# EAGLE design Qwiic_Relay (EAGLE 9.1.0)
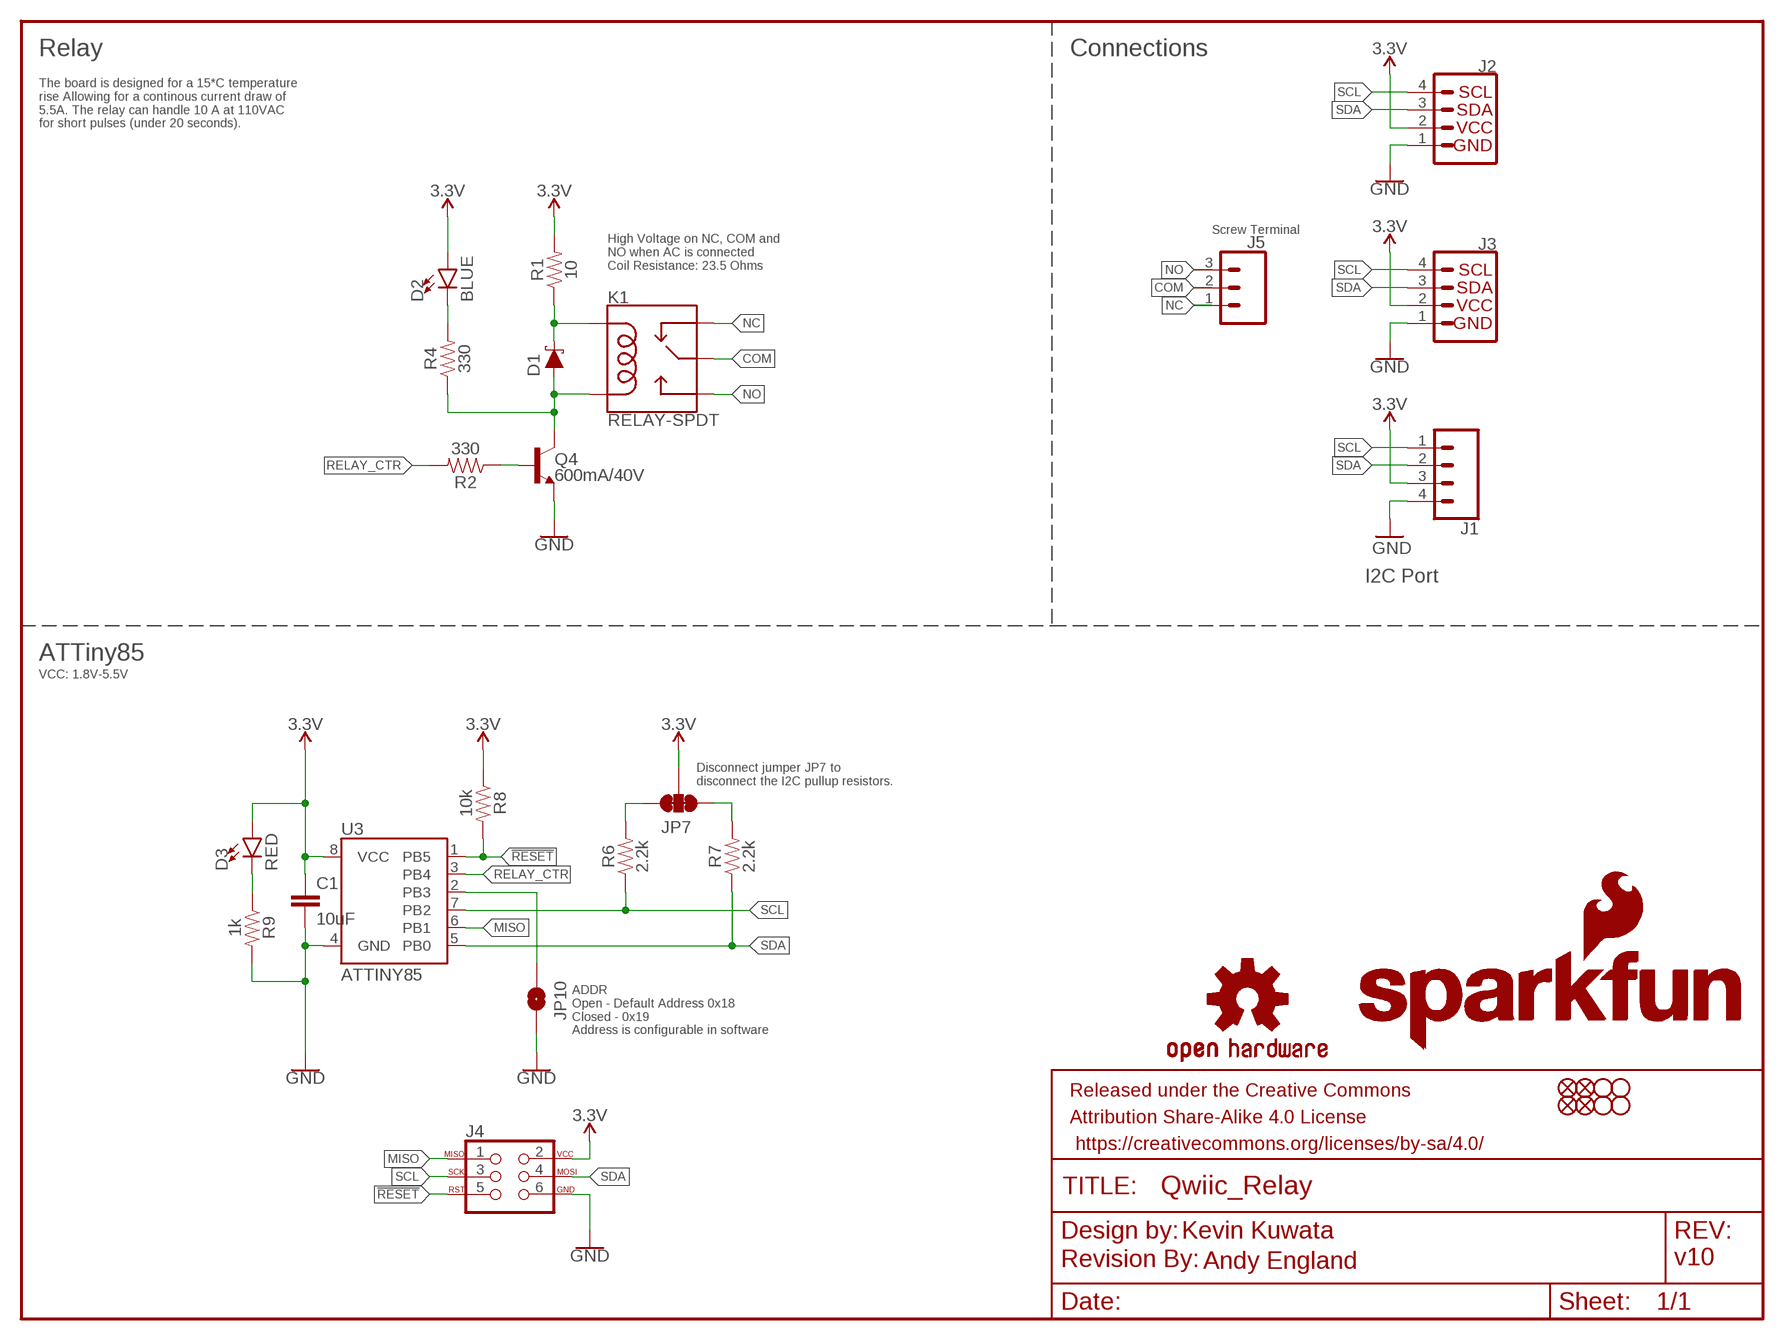
[diagram p0: schematic, sheet 1]

## Parts
C1  10uF  10UF-0603-6.3V-20%  [0603]
D1  1A/23V/620mV  DIODE-SCHOTTKY-BAT20J  [SOD-323]
D2  BLUE  LED-BLUE0603  [LED-0603]
D3  RED  LED-RED0603  [LED-0603]
FRAME1  FRAME-LETTER  [CREATIVE_COMMONS]
J1  CONN_041X04_NO_SILK  [1X04_NO_SILK]
J2  QWIIC_CONNECTORJS-1MM  [1X04_1MM_RA]
J3  QWIIC_CONNECTORJS-1MM  [1X04_1MM_RA]
J4  AVR_SPI_PROG_3X2TESTPOINTS  [2X3_TEST_POINTS]
J5  CONN_03-SCREW-5MM  [SCREWTERMINAL-5MM-3]
JP1  STAND-OFF  [STAND-OFF]
JP2  FIDUCIALUFIDUCIAL  [MICRO-FIDUCIAL]
JP3  STAND-OFF  [STAND-OFF]
JP4  STAND-OFF  [STAND-OFF]
JP5  STAND-OFF  [STAND-OFF]
JP6  FIDUCIALUFIDUCIAL  [MICRO-FIDUCIAL]
JP7  JUMPER-SMT_3_2-NC_TRACE_NO-SILK  [SMT-JUMPER_3_2-NC_TRACE_NO-SILK]
JP8  FIDUCIALUFIDUCIAL  [MICRO-FIDUCIAL]
JP9  FIDUCIALUFIDUCIAL  [MICRO-FIDUCIAL]
JP10  JUMPER-SMT_2_NO_NO-SILK  [SMT-JUMPER_2_NO_NO-SILK]
K1  RELAY-SPDT  [RELAY_G5LE]
LOGO1  OSHW-LOGOMINI  [OSHW-LOGO-MINI]
LOGO2  REVISION  [REVISION]
Q4  600mA/40V  TRANS_NPN-MMBT2222AL  [SOT23-3]
R1  10  10OHM-0603-1/10W-5%  [0603]
R2  330  330OHM-0603-1/10W-1%  [0603]
R4  330  330OHM-0603-1/10W-1%  [0603]
R6  2.2k  2.2KOHM-0603-1/10W-1%  [0603]
R7  2.2k  2.2KOHM-0603-1/10W-1%  [0603]
R8  10k  10KOHM-0603-1/10W-1%  [0603]
R9  1k  1KOHM-0603-1/10W-1%  [0603]
U3  ATTINY85  [ATTINY85]
U$3  SFE_LOGO_NAME.1_INCH  [SFE_LOGO_NAME_.1]
U$4  SFE_LOGO_NAME_FLAME.1_INCH  [SFE_LOGO_NAME_FLAME_.1]

## Nets
3.3V: C1.1 D2.A D3.A J1.3 J2.2 J3.2 J4.2 JP7.2 R1.2 R8.1 U3.8(VCC)
!RESET: J4.5 R8.2 U3.1(PB5)
COM: J5.2 K1.1(MAIN)
GND: C1.2 J1.4 J2.1 J3.1 J4.6 JP10.2 Q4.2(E) R9.2 U3.4(GND)
MISO: J4.1 U3.6(PB1)
N$1: Q4.1(B) R2.1
N$2: D1.A K1.5(COIL2) Q4.3(C) R4.1
N$4: JP7.1 R7.2
N$5: JP10.1 U3.2(PB3)
N$7: D1.C K1.2(COIL1) R1.1
N$8: D2.C R4.2
N$10: JP7.3 R6.2
N$13: D3.C R9.1
NC: J5.1 K1.4(NC)
NO: J5.3 K1.3(NO)
RELAY_CTR: R2.2 U3.3(PB4)
SCL: J1.1 J2.4 J3.4 J4.3 R6.1 U3.7(PB2)
SDA: J1.2 J2.3 J3.3 J4.4 R7.1 U3.5(PB0)

## Notes on the sheet
- Relay | Connections
- The board is designed for a 15*C temperature 
  rise Allowing for a continous current draw of 
  5.5A. The relay can handle 10 A at 110VAC 
  for short pulses (under 20 seconds).
- Screw Terminal
- High Voltage on NC, COM and 
  NO when AC is connected
  Coil Resistance: 23.5 Ohms
- I2C Port
- ATTiny85
- VCC: 1.8V-5.5V
- Disconnect jumper JP7 to 
  disconnect the I2C pullup resistors.
- ADDR
  Open - Default Address 0x18
  Closed - 0x19
  Address is configurable in software
- Kevin Kuwata
- Andy England | v10

## Library data of the parts
C1 = SparkFun-Capacitors:10UF: 10.0µF ceramic capacitors A capacitor is a passive two-terminal electrical component used to store electrical energy temporarily in an electric field.; PROD_ID: CAP-11015
D1 = SparkFun-DiscreteSemi:DIODE-SCHOTTKY: Schottky diode A Schottky diode is a semiconductor diode which has a low forward voltage drop and a very fast switching action.; PROD_ID: DIO-11623
D2 = SparkFun-LED:LED-BLUE: Blue SMD LED Used in manufacturing of various products at SparkFun Packages: 0603 - SMD 0603 package [Product Link] <http://www.digikey.com/product-detail/en/SMLE12BC7TT86/511-1589-2-ND/1641808> 1206 - SMD1206 package [Product Link] <http://www.digikey.com/product-detail/en/lite-on-inc/LTST-C150TBKT/160-1643-1-ND/573584> SparkFun Products: ESP8266 Thing-Dev Board <https://www.sparkfun.com/products/13711> RedBoard <https://www.sparkfun.com/products/12757>; PROD_ID: DIO-08575
D3 = SparkFun-LED:LED-RED: Red SMD LED Used in manufacturing of most products at SparkFun Packages: 0603 - SMD 0603 package [Product Link] <http://docs.avagotech.com/docs/AV02-0551EN> 0603 SMART - SMD 0603 SMART package ( more efficient and expensive)[Product Link] <http://www.osram-os.com/Graphics/XPic2/00077099_0.pdf> 1206 - SMD1206 package [Product Link] <https://www.sparkfun.com/datasheets/DevTools/LilyPad/Q150OVS4.pdff> SparkFun Products: Pro Mini 328 -5V <https://www.sparkfun.com/products/821> RedBoard <https://www.sparkfun.com/products/12757> IOIO-OTG <https://www.sparkfun.com/products/13613>; PROD_ID: DIO-00819
FRAME1 = SparkFun-Aesthetics:FRAME-LETTER: Schematic Frame - Letter Standard 8.5x11 US Letter frame
J1 = SparkFun-Connectors:CONN_04: Multi connection point. Often used as Generic Header-pin footprint for 0.1 inch spaced/style header connections On any of the 0.1 inch spaced packages, you can populate with these: Break Away Headers - Straight <https://www.sparkfun.com/products/116> (PRT-00116) Break Away Male Headers - Right Angle <https://www.sparkfun.com/products/553> (PRT-00553) Female Headers <https://www.sparkfun.com/products/115> (PRT-00115) Break Away Headers - Machine Pin <https://www.sparkfun.com/products/117> (PRT-00117) Break Away Female Headers - Swiss Machine Pin <https://www.sparkfun.com/products/743> (PRT-00743) For SCREWTERMINALS and SPRING TERMINALS visit here: Screw Terimnals on SparkFun.com <https://www.sparkfun.com/search/results?term=Screw+Terminals> (5mm/3.5mm/2.54mm spacing) This device is also useful as a general connection point to wire up your design to another part of your project. Our various solder wires solder well into these plated through hole pads. Hook-Up Wire - Assortment (Stranded, 22 AWG) <https://www.sparkfun.com/products/11375> (PRT-11375) Hook-Up Wire - Assortment (Solid Core, 22 AWG) <https://www.sparkfun.com/products/11367> (PRT-11367) View the entire wire category on our website here <https://www.sparkfun.com/categories/141> Special notes: Molex polarized connector foot print use with SKU : PRT-08231 with associated crimp pins and housings. 1MM SMD Version SKU: PRT-10208; PROD_ID: CONN-09696
J2 J3 = SparkFun-Connectors:QWIIC_CONNECTOR: SparkFun I2C Standard Qwiic Connector An SMD 1mm pitch JST connector makes it easy and quick (get it? Qwiic?) to connect I2C devices to each other. The Qwiic system <http://www.sparkfun.com/qwiic> enables fast and solderless connection between popular platforms and various sensors and actuators. We carry 200mm <https://www.sparkfun.com/products/14204>, 100mm <https://www.sparkfun.com/products/14205>, 50mm <https://www.sparkfun.com/products/14206>, and breadboard friendly <https://www.sparkfun.com/products/14207> Qwiic cables. We also offer 10 pcs strips <https://www.sparkfun.com/products/14323> the SMD connectors.; PROD_ID: CONN-13694
J4 = SparkFun-Connectors:AVR_SPI_PROG_3X2: AVR ISP 6 Pin This is the reduced ISP connector for AVR programming. Common on Arduino. This footprint will take up less PCB space and can be used with a 10-pin to 6-pin adapter such as SKU: BOB-08508 **Special note about "TEST_POINT" package. The stop mask is on the top side, so if you want your programming test points to be on the bottom of your board, make sure to place this package on the bottom side of the board. This also ensure that the orientation to program from the bottom side will be correct. SparkFun Products: SparkFun ISP Pogo Adapter <https://www.sparkfun.com/products/11591> - NS Tiny AVR Programmer <https://www.sparkfun.com/products/11801> -PTH
J5 = SparkFun-Connectors:CONN_03: Multi connection point. Often used as Generic Header-pin footprint for 0.1 inch spaced/style header connections On any of the 0.1 inch spaced packages, you can populate with these: Break Away Headers - Straight <https://www.sparkfun.com/products/116> (PRT-00116) Break Away Male Headers - Right Angle <https://www.sparkfun.com/products/553> (PRT-00553) Female Headers <https://www.sparkfun.com/products/115> (PRT-00115) Break Away Headers - Machine Pin <https://www.sparkfun.com/products/117> (PRT-00117) Break Away Female Headers - Swiss Machine Pin <https://www.sparkfun.com/products/743> (PRT-00743) Stackable Header - 3 Pin (Female, 0.1") <https://www.sparkfun.com/products/13875> (PRT-13875) For SCREWTERMINALS and SPRING TERMINALS visit here: Screw Terimnals on SparkFun.com <https://www.sparkfun.com/search/results?term=Screw+Terminals> (5mm/3.5mm/2.54mm spacing) This device is also useful as a general connection point to wire up your design to another part of your project. Our various solder wires solder well into these plated through hole pads. Hook-Up Wire - Assortment (Stranded, 22 AWG) <https://www.sparkfun.com/products/11375> (PRT-11375) Hook-Up Wire - Assortment (Solid Core, 22 AWG) <https://www.sparkfun.com/products/11367> (PRT-11367) View the entire wire category on our website here <https://www.sparkfun.com/categories/141> Special notes: Molex polarized connector foot print use with SKU : PRT-08232 with associated crimp pins and housings.; PROD_ID: CONN-10134; SF_SKU: PRT-08433
JP1 JP3-JP5 = SparkFun:STAND-OFF: Stand Off This is the mechanical footprint for a #4 phillips button head screw. Use the keepout ring to avoid running the screw head into surrounding components. SKU : PRT-00447
JP2 JP6 JP8 JP9 = SparkFun:FIDUCIAL: Fiducial Alignment Points Various fiducial points for machine vision alignment.
JP7 = SparkFun-Jumpers:JUMPER-SMT_3_2-NC_TRACE: Normally closed trace jumper (2 of 2 connections) This jumper has a trace between all three pads so they are normally closed (NC). Use a razor knife to open the connection(s). For best results follow the IPC guidelines for cutting traces: Cutout at least 0.063 mm (0.005 in). Remove all loose material to clean up the cut area. Seal the cut with an approved epoxy. Reapply solder to reclose the connection(s).
JP10 = SparkFun-Jumpers:JUMPER-SMT_2_NO: Normally open jumper This jumper has two pads in close proximity to each other. Apply solder to close the connection. Round pads are easier to solder for beginners, but are a lot larger. SparkFun Product that uses the round pads: SparkFun EL Sequencer <https://www.sparkfun.com/products/12781>
K1 = SparkFun-Electromechanical:RELAY-SPDT: SPDT Electromechanical Relay Single-pole, double-throw sealed relays. When current is applied to the coil, it throws a simple changeover switch, terminating the connection from the NC contact to ground and closing the NO contact. Use them to switch high voltage/high current devices. SparkFun Products JQX-15F: Relay SPDT Sealed - 20A <https://www.sparkfun.com/products/10924> (COM-10924) JZC-11F: Relay SPDT Sealed <https://www.sparkfun.com/products/100> (COM-00100); PROD_ID: COMP-14214
LOGO1 = SparkFun-Aesthetics:OSHW-LOGO: Open-Source Hardware (OSHW) Logo This logo indicates the piece of hardware it is found on incorporates a OSHW license and/or adheres to the definition of open source hardware found here: http://freedomdefined.org/OSHW
LOGO2 = SparkFun-Aesthetics:REVISION: "Revision By" Text Preceding text for revisor documentation. Includes schematic text on "symbols" layer, and board text on tDoc.
Q4 = SparkFun-DiscreteSemi:TRANS_NPN: NPN transistor Current controlled devices typically used to amplify current or used as a switch. BC547 - COM-08928 <http://www.sparkfun.com/products/8928> (TO-92 45V 100mA) (1.Collector 2.Base 3.Emitter) 2N3904 - COM-00521 <http://www.sparkfun.com/products/521> (TO-92 40V 200mA) (1.Emitter 2.Base 3.Collector) P2N2222A - COM-12852 <http://www.sparkfun.com/products/12852> (TO-92 40V 600mA) (1.Collector 2.Base 3.Emitter); PROD_ID: TRANS-08049
R1 = SparkFun-Resistors:10OHM: 10Ω resistor A resistor is a passive two-terminal electrical component that implements electrical resistance as a circuit element. Resistors act to reduce current flow, and, at the same time, act to lower voltage levels within circuits. - Wikipedia; PROD_ID: RES-09834
R2 R4 = SparkFun-Resistors:330OHM: 330Ω resistor A resistor is a passive two-terminal electrical component that implements electrical resistance as a circuit element. Resistors act to reduce current flow, and, at the same time, act to lower voltage levels within circuits. - Wikipedia; PROD_ID: RES-00818
R6 R7 = SparkFun-Resistors:2.2KOHM: 2.2kΩ resistor A resistor is a passive two-terminal electrical component that implements electrical resistance as a circuit element. Resistors act to reduce current flow, and, at the same time, act to lower voltage levels within circuits. - Wikipedia; PROD_ID: RES-08272
R8 = SparkFun-Resistors:10KOHM: 10kΩ resistor A resistor is a passive two-terminal electrical component that implements electrical resistance as a circuit element. Resistors act to reduce current flow, and, at the same time, act to lower voltage levels within circuits. - Wikipedia; PROD_ID: RES-00824
R9 = SparkFun-Resistors:1KOHM: 1kΩ resistor A resistor is a passive two-terminal electrical component that implements electrical resistance as a circuit element. Resistors act to reduce current flow, and, at the same time, act to lower voltage levels within circuits. - Wikipedia; PROD_ID: RES-07856
U3 = SparkFun-IC-Microcontroller:ATTINY85; PROD_ID: IC-09092
U$3 = SparkFun-Aesthetics:SFE_LOGO_NAME: SparkFun Font Logo This is the SparkFun name logo. The logo on the schematic will always be the same size; the package variant is the height of the flame part of the logo (or the height the flame would be, if it were drawn). Default layer for the logo on the board is tSilk.
U$4 = SparkFun-Aesthetics:SFE_LOGO_NAME_FLAME: SparkFun Font Logo w/ Flame This is the SparkFun full logo. The logo on the schematic will always be the same size; the package variant is the height of the flame part of the logo. Default layer for the logo on the board is tSilk.

## Board
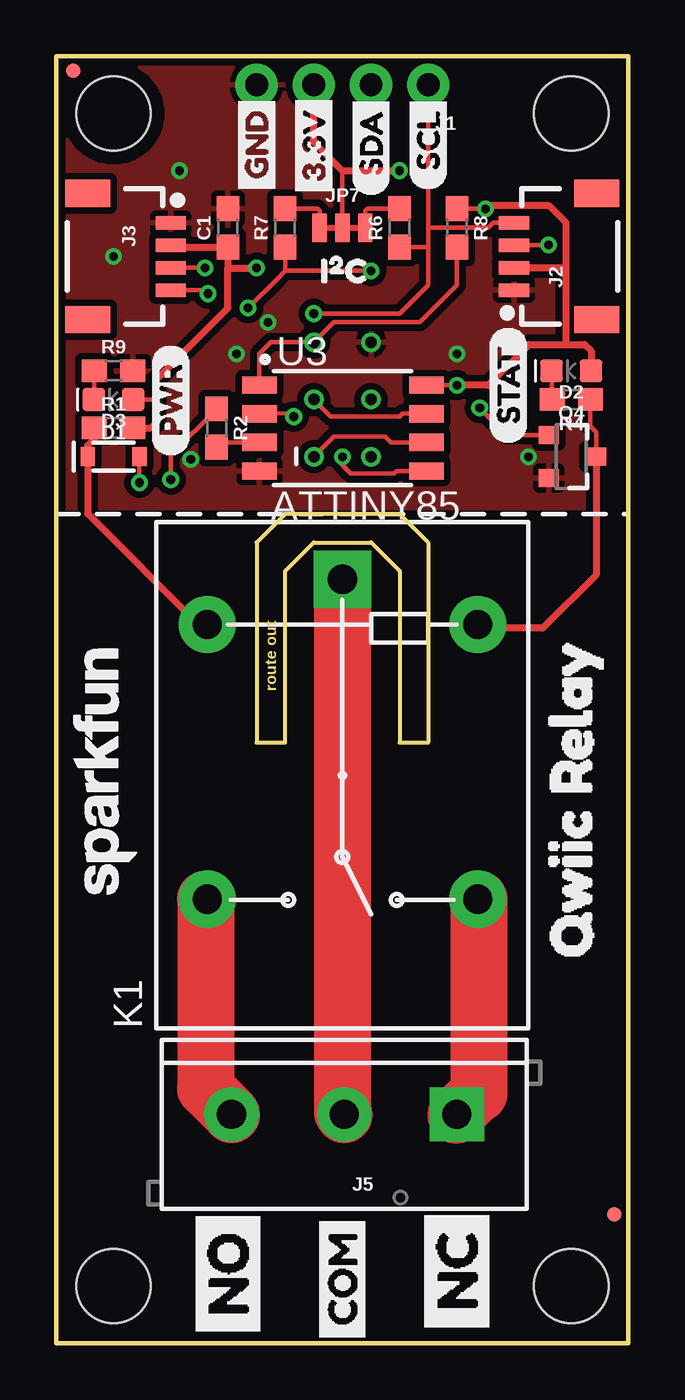
[diagram p1: board, top side]
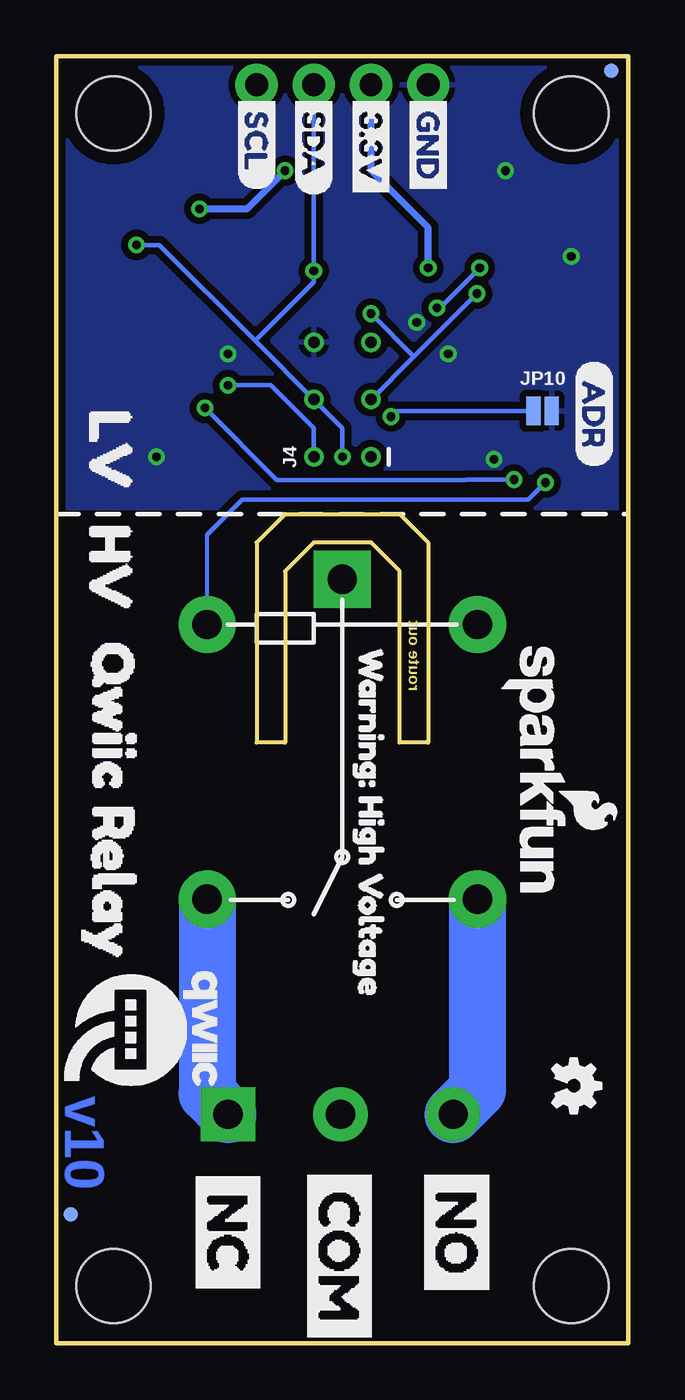
[diagram p2: board, bottom side, seen from below]

Size 25.4 x 57.15 mm. Coordinates in mm from the lower left corner, seen from the top.
Outline: 0,0 25.4,0 25.4,57.15 0,57.15 0,0
Copper layers (1*16): Top 0.035mm / dielectric 1.5mm / Bottom 0.035mm
Design rules "SparkFun-2-layer-TIGHT": minimum track width 7mil, minimum drill 15mil, track to track 7mil, track to pad 7mil, pad to pad 7mil, via to via 7mil, smd to smd 7mil, copper to edge 7mil, drill to drill 7mil, minimum pad ring 7mil, minimum via ring 7mil, stop-mask expansion 4mil, vias tented up to drill 25mil, thermal gap 10mil
Milling: 12 lines

### Footprints (pad centres in the part's own frame; a part is rotated, then mirrored left to right if it is on the bottom)
0603 = smd 1.1 x 1: 1 -0.85,0; 2 0.85,0
SOD-323 = smd 0.63 x 0.83: A 1.15,0; C -1.15,0
LED-0603 = smd 1 x 1: A -0.877,0; C 0.877,0
1X04_NO_SILK = drill 1.016 pad 1.88: 1 0,0; 2 2.54,0; 3 5.08,0; 4 7.62,0
1X04_1MM_RA = smd 0.6 x 1.35: 1 -1.5,0; 2 -0.5,0; 3 0.5,0; 4 1.5,0 | smd 1.2 x 2: NC1 2.8,-3.675; NC2 -2.8,-3.675
2X3_TEST_POINTS = drill 0.508: 1 -2.54,-1.27; 2 -2.54,1.27; 3 0,-1.27; 4 0,1.27; 5 2.54,-1.27; 6 2.54,1.27
SCREWTERMINAL-5MM-3 = drill 1.3 pad 2.413 square: 1 0,0 | drill 1.3 pad 2.413: 2 5,0; 3 10,0
STAND-OFF = hole 3.302: 0,0
MICRO-FIDUCIAL = smd 0.635 x 0.635: 1 0,0
SMT-JUMPER_3_2-NC_TRACE_NO-SILK = smd 0.635 x 1.27: 1 -1.016,0; 2 0,0; 3 1.016,0
SMT-JUMPER_2_NO_NO-SILK = smd 0.635 x 1.27: 1 -0.406,0; 2 0.406,0
RELAY_G5LE = drill 1.3 pad 2.54 square: 1 8.52,-0.005 | drill 1.3 pad 2.54: 2 6.52,5.995; 3 -5.68,5.995; 4 -5.68,-6.005; 5 6.52,-6.005
SOT23-3 = smd 0.8 x 0.9: 1 -0.95,-1; 2 0.95,-1; 3 0,1.1
ATTINY85 = smd 1.524 x 0.762: 1 -3.683,1.905; 2 -3.683,0.635; 3 -3.683,-0.635; 4 -3.683,-1.905; 5 3.727,-1.905; 6 3.727,-0.635; 7 3.727,0.635; 8 3.727,1.905

### Placement (x,y rotation side)
C1  7.62,49.53 90 top
D1  2.54,39.37 0 top
D2  22.86,43.18 180 top
D3  2.54,41.91 180 top
FRAME1  -16.51,-8.89 0 top  (outside the outline)
J1  16.51,55.88 180 top
J2  20.32,48.26 90 top
J3  5.08,48.26 270 top
J4  12.7,41.91 90 bottom
J5  17.78,10.16 180 top
JP1  2.54,2.54 0 top
JP2  0.76,56.52 0 bottom
JP3  2.54,54.61 0 top
JP4  22.86,54.61 0 top
JP5  22.86,2.54 0 top
JP6  24.77,5.71 0 bottom
JP7  12.7,49.53 0 top
JP8  24.77,5.71 0 top
JP9  0.76,56.52 0 top
JP10  3.81,41.4 0 bottom
K1  12.7,25.4 90 top
LOGO1  2.41,11.43 270 bottom
LOGO2  -5.08,-11.43 0 top  (outside the outline)
Q4  22.86,39.37 270 top
R1  2.54,40.64 0 top
R2  7.11,40.64 270 top
R4  22.86,41.91 180 top
R6  15.24,49.53 90 top
R7  10.16,49.53 90 top
R8  17.78,49.53 270 top
R9  2.54,43.18 0 top
U3  12.7,40.64 0 top
U$1  [QWIIC-LOGO-MEDIUM]  21.59,13.97 270 bottom
U$2  [(PWR)]  5.08,39.37 90 top
U$3  2.16,25.4 90 top
U$4  4.19,25.4 270 bottom
U$5  [SCL]  16.51,55.63 270 bottom
U$6  [SDA]  13.97,55.63 270 bottom
U$7  [3.3V]  11.43,55.63 270 bottom
U$8  [GND]  8.89,55.63 270 bottom
U$9  [(ADR)]  1.52,43.69 270 bottom
U$10  [ORDERING_INSTRUCTIONS]  -34.29,-13.97 0 top  (outside the outline)
U$11  [NO2]  7.62,-0.38 90 top
U$12  [COM7]  12.7,-0.38 90 top
U$13  [GND]  8.89,50.8 90 top
U$14  [I__C1]  10.79,47.62 0 top
U$15  [_QWIIC_RELAY0]  22.86,14.86 90 top
U$16  [_QWIIC_RELAY0]  22.86,33.4 270 bottom
U$17  [NC3]  17.78,8.26 270 bottom
U$18  [NO2]  7.62,8.38 270 bottom
U$19  [COM4]  12.83,8.38 270 bottom
U$20  [NC3]  17.78,-0.13 90 top
U$21  [20]  11.43,47.88 0 top
U$22  [3.3V]  11.43,50.67 90 top
U$23  [SCL1]  16.51,51.18 90 top
U$24  [SDA0]  13.97,50.93 90 top
U$25  [STAT1]  20.07,39.88 90 top
U$26  [WARNING#_HIGH_VOLTAGE0]  11.43,31.75 270 bottom
U$27  [HV2]  22.99,37.97 270 bottom
U$28  [LV1]  22.99,43.05 270 bottom

### Tracks (layer width: path | path; a pad name or v marks a point on that pad's centre or on a via)
3.3V  (via drill 0.38)
  Top 0.203: JP7.2 12.7,50.8 12.7,52.07 | v19.05,50.38 R8.1 | J3.2 5.16,48.68 | 4.45,41.91 D3.A | v17.78,42.55 U3.8 | 22.6,47.76 22.61,47.75 | 20.98,44.35
  Top 0.305: D2.A 23.74,44.07 23.45,44.35 22.61,44.35 | 7.62,47.75 C1.1 5.16,48.68 | 7.62,47.75 v8.89,47.75 | J1.3 11.43,53.34 12.7,52.07 v15.24,52.07 | 7.62,47.75 7.62,45.97 4.45,42.8 4.45,41.91 4.45,40.89 4.19,40.64 R1.2 | v17.78,42.55 19.18,42.55 20.98,44.35 22.61,44.35 | 22.61,44.35 22.61,47.75 22.61,49.78 21.88,50.51 19.18,50.51 v19.05,50.38 | J2.2 22.6,47.76
  Bottom 0.203: J4.2 13.97,40.64 15.88,42.55 v17.78,42.55
  Bottom 0.305: v8.89,47.75 8.89,49.53 11.43,52.07 J1.3 | v19.05,50.38 16.93,50.38 v15.24,52.07
!RESET
  Top 0.178: U3.1
  Top 0.203: U3.1 9.02,43.94 9.53,44.45 10.16,44.45 | R8.2 17.78,46.99 16.13,45.34 12.32,45.34 J4.5 10.16,44.45 | 10.16,44.45
COM
  Top 0.254: 12.75,10.19 J5.2
  Top 2.54: J5.2 12.71,10.23 K1.1
GND  (via drill 0.38)
  other vias: 20.95,39.37 5.46,52.07 2.54,48.26 17.78,43.94 8,43.94 9.4,45.34 5.97,39.24
  pour Top (isolate 0.305): 0,37.08 0,57.15 25.4,57.15 25.4,37.08
  pour Bottom (isolate 0.305): 0,37.08 25.4,37.08 25.4,57.15 0,57.15
MISO
  Top 0.203: U3.6 14.86,40.01 14.61,40.26 12.32,40.26 J4.1
N$1  (via drill 0.38)
  Top 0.203: Q4.1 20,40.32 v18.8,41.53 | R2.1 5.08,39.46 v5.08,38.35
  Bottom 0.203: v5.08,38.35 7.21,38.35 7.22,38.34 15.61,38.34 v18.8,41.53
N$2  (via drill 0.38)
  Top 0.178: 18.88,31.75 K1.5
  Top 0.203: D1.A v3.69,38.22 | R4.1 23.71,40.72 23.96,40.47 Q4.3
  Top 0.305: Q4.3 23.96,34.12 21.59,31.75 18.88,31.75
  Bottom 0.178: K1.5 18.7,35.91
  Bottom 0.203: 18.7,35.91 17.14,37.47 4.45,37.47 v3.69,38.22
N$4
  Top 0.203: R7.2 11.6,50.38 11.68,50.29 JP7.1
N$5  (via drill 0.38)
  Top 0.178: v10.54,41.15 10.41,41.27 8.89,41.27 | U3.2
  Top 0.203: 8.89,41.27 U3.2
  Bottom 0.203: v10.54,41.15 10.29,41.4 JP10.1
N$7
  Top 0.305: K1.2 6.31,31.92 1.39,36.84 D1.C 1.39,39.87 1.69,40.17 R1.1
N$8
  Top 0.203: D2.C 21.98,41.94 R4.2
N$10
  Top 0.203: R6.2 13.8,50.38 13.72,50.29 JP7.3
N$13
  Top 0.203: R9.1 1.69,41.94 D3.C
NC
  Top 0.254: J5.1 18.7,11.09 K1.4 18.7,11.48 18.76,11.43
  Top 2.54: 18.76,19.72 18.76,11.43 18.76,11.09 | 17.74,10.12 J5.1 18.67,11.05
  Bottom 2.54: K1.4 18.7,11.09 J5.1
NO
  Top 2.54: 6.63,19.72 6.63,11.31 J5.3
  Bottom 2.54: K1.3 6.71,11.23 J5.3
RELAY_CTR
  Top 0.178: U3.3
  Top 0.203: U3.3 7.62,40.01 7.41,39.79 R2.2
SCL  (via drill 0.38)
  Top 0.203: U3.7 15.37,41.27 15.24,41.15 12.19,41.15 J4.3 | v6.73,46.61 6.58,46.76 J3.4 | J2.4 19.41,49.76 19.18,49.53 16.51,49.53 | 16.51,49.53 J1.1 | 16.51,49.53 16.51,48.64 | 16.51,48.64 16.51,46.99 15.24,45.72 v11.43,45.72 | 16.51,48.64 16.47,48.68 R6.1
  Bottom 0.178: 9.53,43.81 | v6.73,46.61
  Bottom 0.203: J4.3 9.53,43.81 | v6.73,46.61 9.53,43.81 | v11.43,45.72 9.53,43.81
SDA  (via drill 0.38)
  Top 0.203: J2.3 19.82,48.76 19.83,48.77 v21.84,48.77 | J3.3 v6.6,47.76 v6.6,47.75 | v8.51,45.97 9.84,47.31 10.16,47.62 | 10.16,47.62 R7.1 | 10.16,47.62 v13.97,47.62 | v12.7,39.37 12.7,38.99 13.08,38.61 14.99,38.61 15.11,38.73 U3.5
  Bottom 0.203: 16.57,44.51 20.83,48.77 v21.84,48.77 | J1.2 v13.97,47.62 13.97,47.12 16.57,44.51 | 16.57,44.51 J4.4 12.7,40.64 v12.7,39.37 | v6.6,47.75 8.38,45.97 v8.51,45.97

### Text on the board
Bottom: v10
Dimension: route out
tValues: ATTiny85 | 3V Relay | 3 Pin 5mm Screw Terminal
tDocu: Max Current 5.5A @ 240VAC / 100 mil width / 15 *C Rise / 2 Oz Cu | The relay is rated for 10A at 110VAC or / 5A at 250VAC. The current is limited by / the FR4 glass transition temperature- typically 135 *C. / Theoretical maximum const current draw is 7A. Pulsed current can be higher. / https://www.qorvo.com/design-hub/design-tools/trace-width-calculator | http://www.sphere.bc.ca/class/downloads/ipc_2221a-pcb%20standards.pdf / / Table 6-1 : Electrical Conductor Spacing / 6.3.2 B2-External conductors, Uncoated, Seal Level to 3050 m / 300 to 500 V below 3050 m / 2.5 mm >= Clearance | Kevin Kuwata | Andy England | 2 Oz. Copper